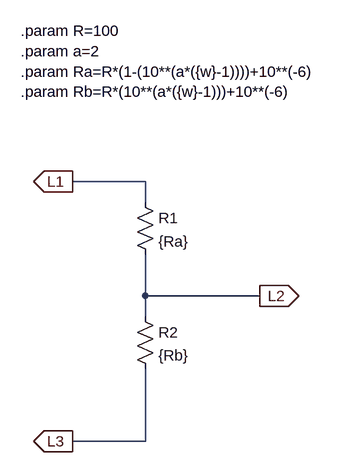
[diagram p0: schematic Base_AxxxK.asc]
Base_AxxxK.asc, the LTspice schematic file:
Version 4
SHEET 1 880 680
WIRE 160 96 48 96
WIRE 160 128 160 96
WIRE 160 272 160 208
WIRE 336 272 160 272
WIRE 160 304 160 272
WIRE 160 496 160 384
WIRE 160 496 48 496
FLAG 336 272 L2
IOPIN 336 272 Out
FLAG 48 96 L1
IOPIN 48 96 Out
FLAG 48 496 L3
IOPIN 48 496 Out
SYMBOL res 144 112 R0
SYMATTR InstName R1
SYMATTR Value {Ra}
SYMBOL res 144 288 R0
SYMATTR InstName R2
SYMATTR Value {Rb}
TEXT -32 -136 Left 2 !.param R=100\n.param a=2\n.param Ra=R*(1-(10**(a*({w}-1))))+10**(-6)\n.param Rb=R*(10**(a*({w}-1)))+10**(-6)

The netlist it stands for:
* Base_AxxxK.asc
R1 L1 L2 {Ra}
R2 L2 L3 {Rb}
.param R=100
.param a=2
.param Ra=R*(1-(10**(a*({w}-1))))+10**(-6)
.param Rb=R*(10**(a*({w}-1)))+10**(-6)
.backanno
.end